# Altium project PCB_Project.PrjPcb
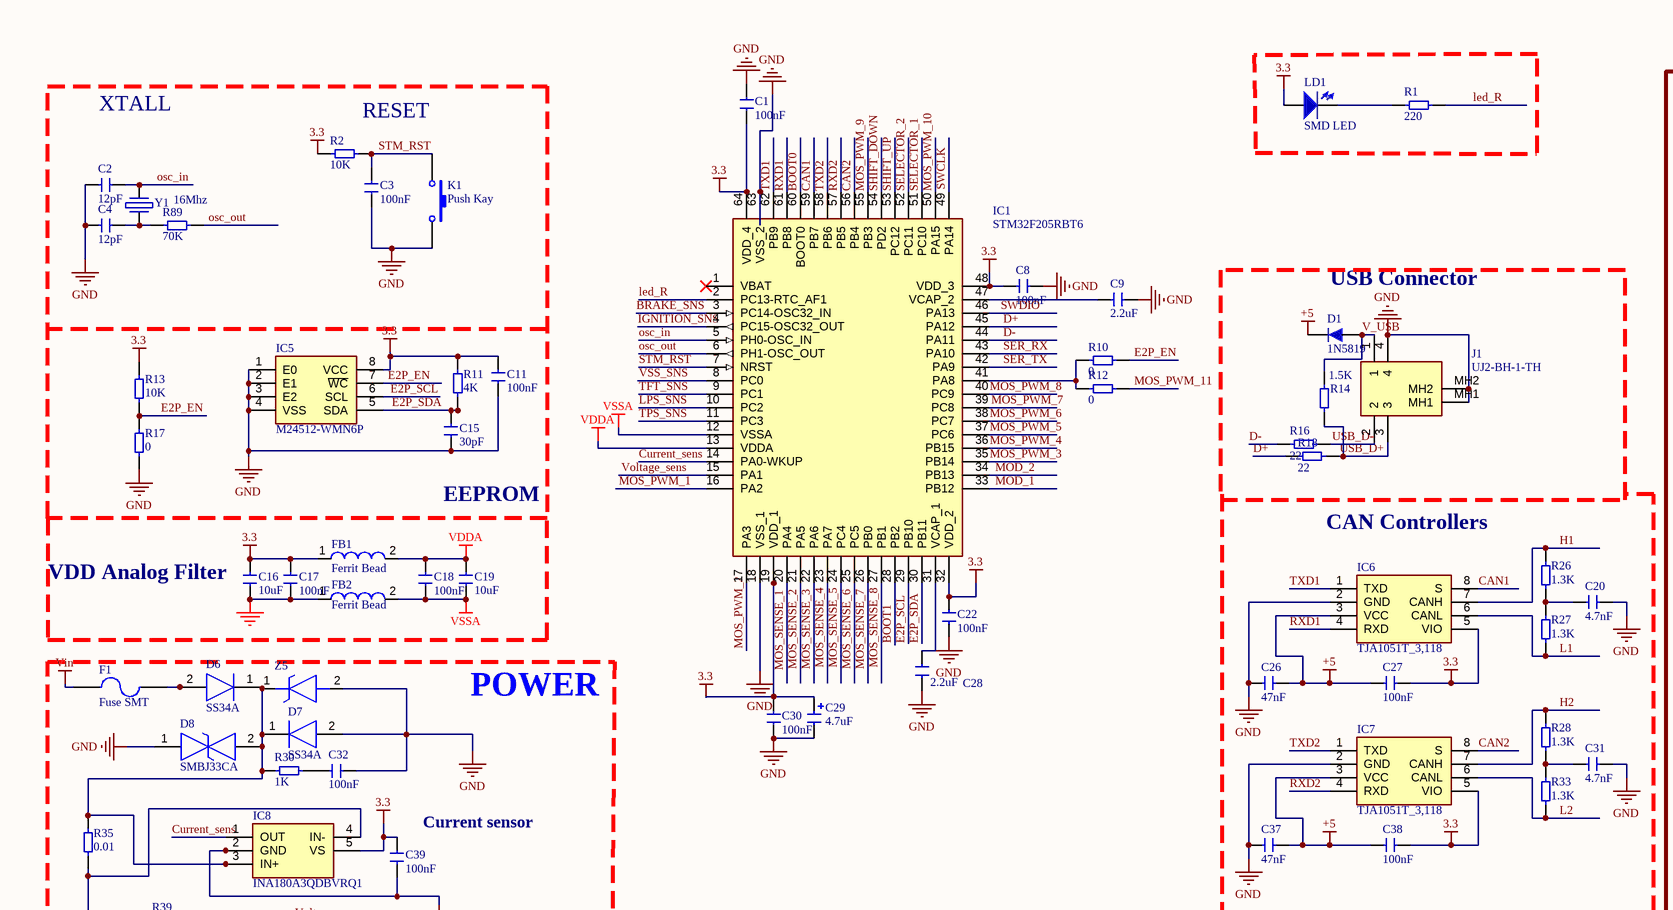
[diagram p0: Sheet_TCU.SchDoc, top left]
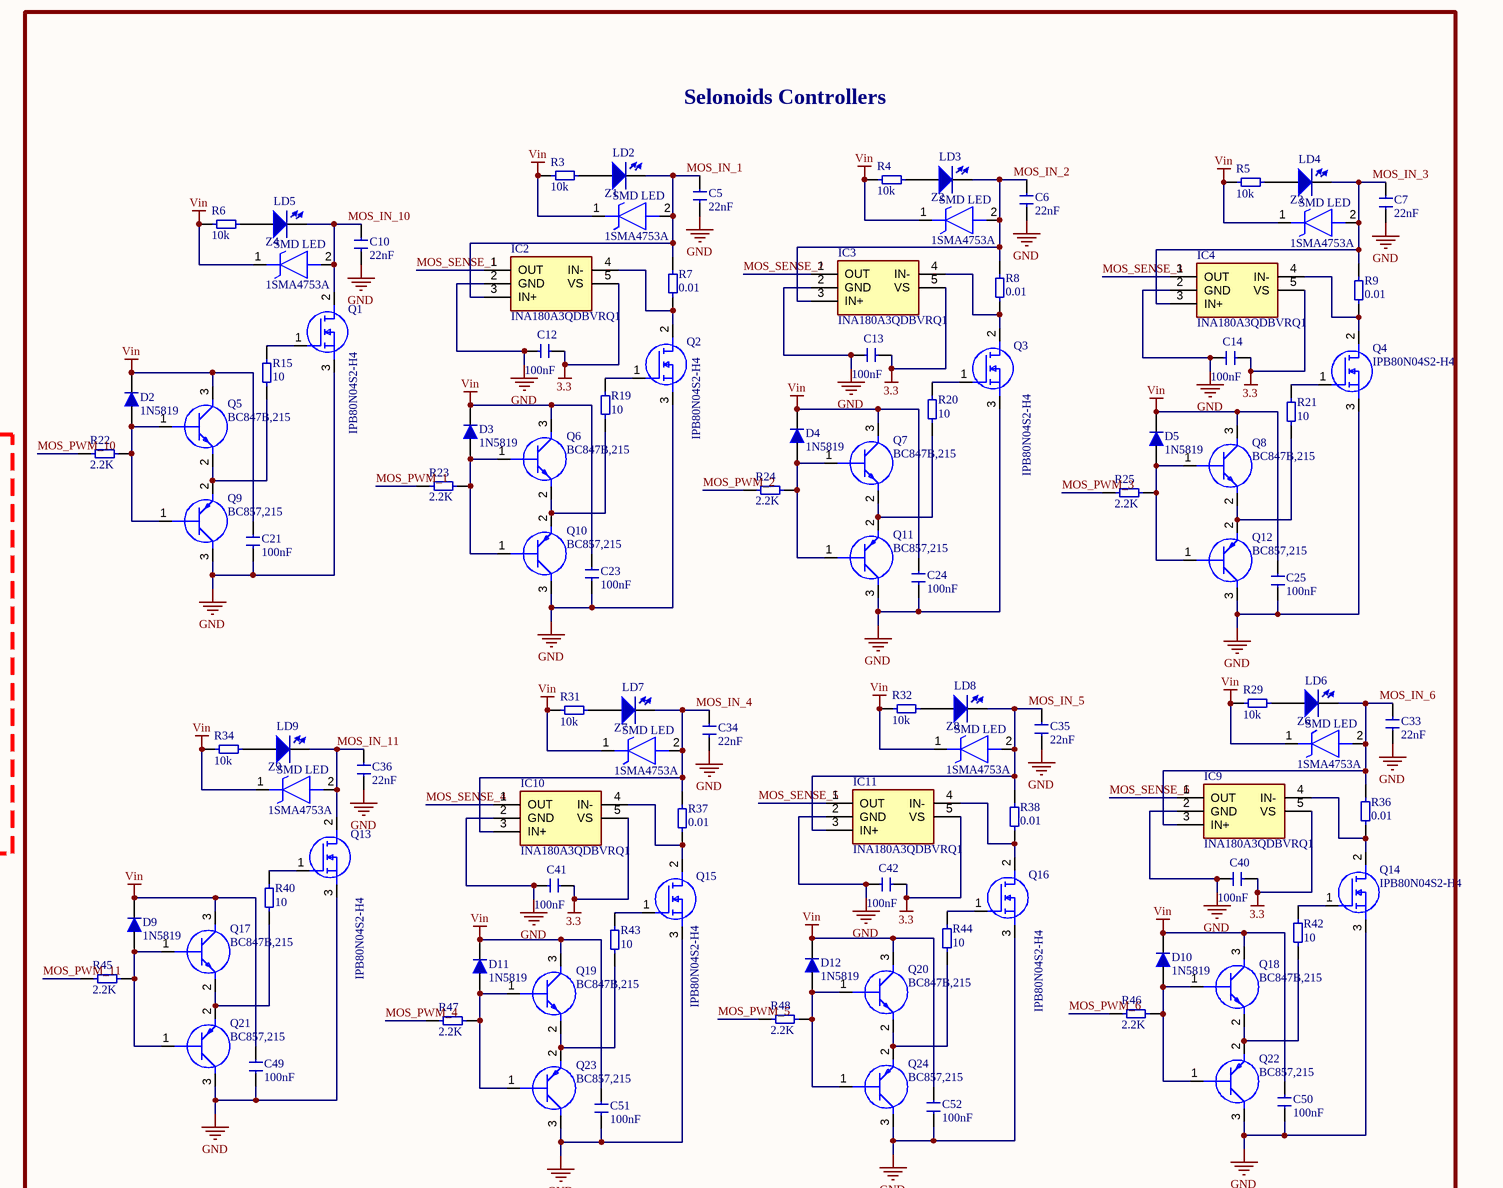
[diagram p1: Sheet_TCU.SchDoc, top right]
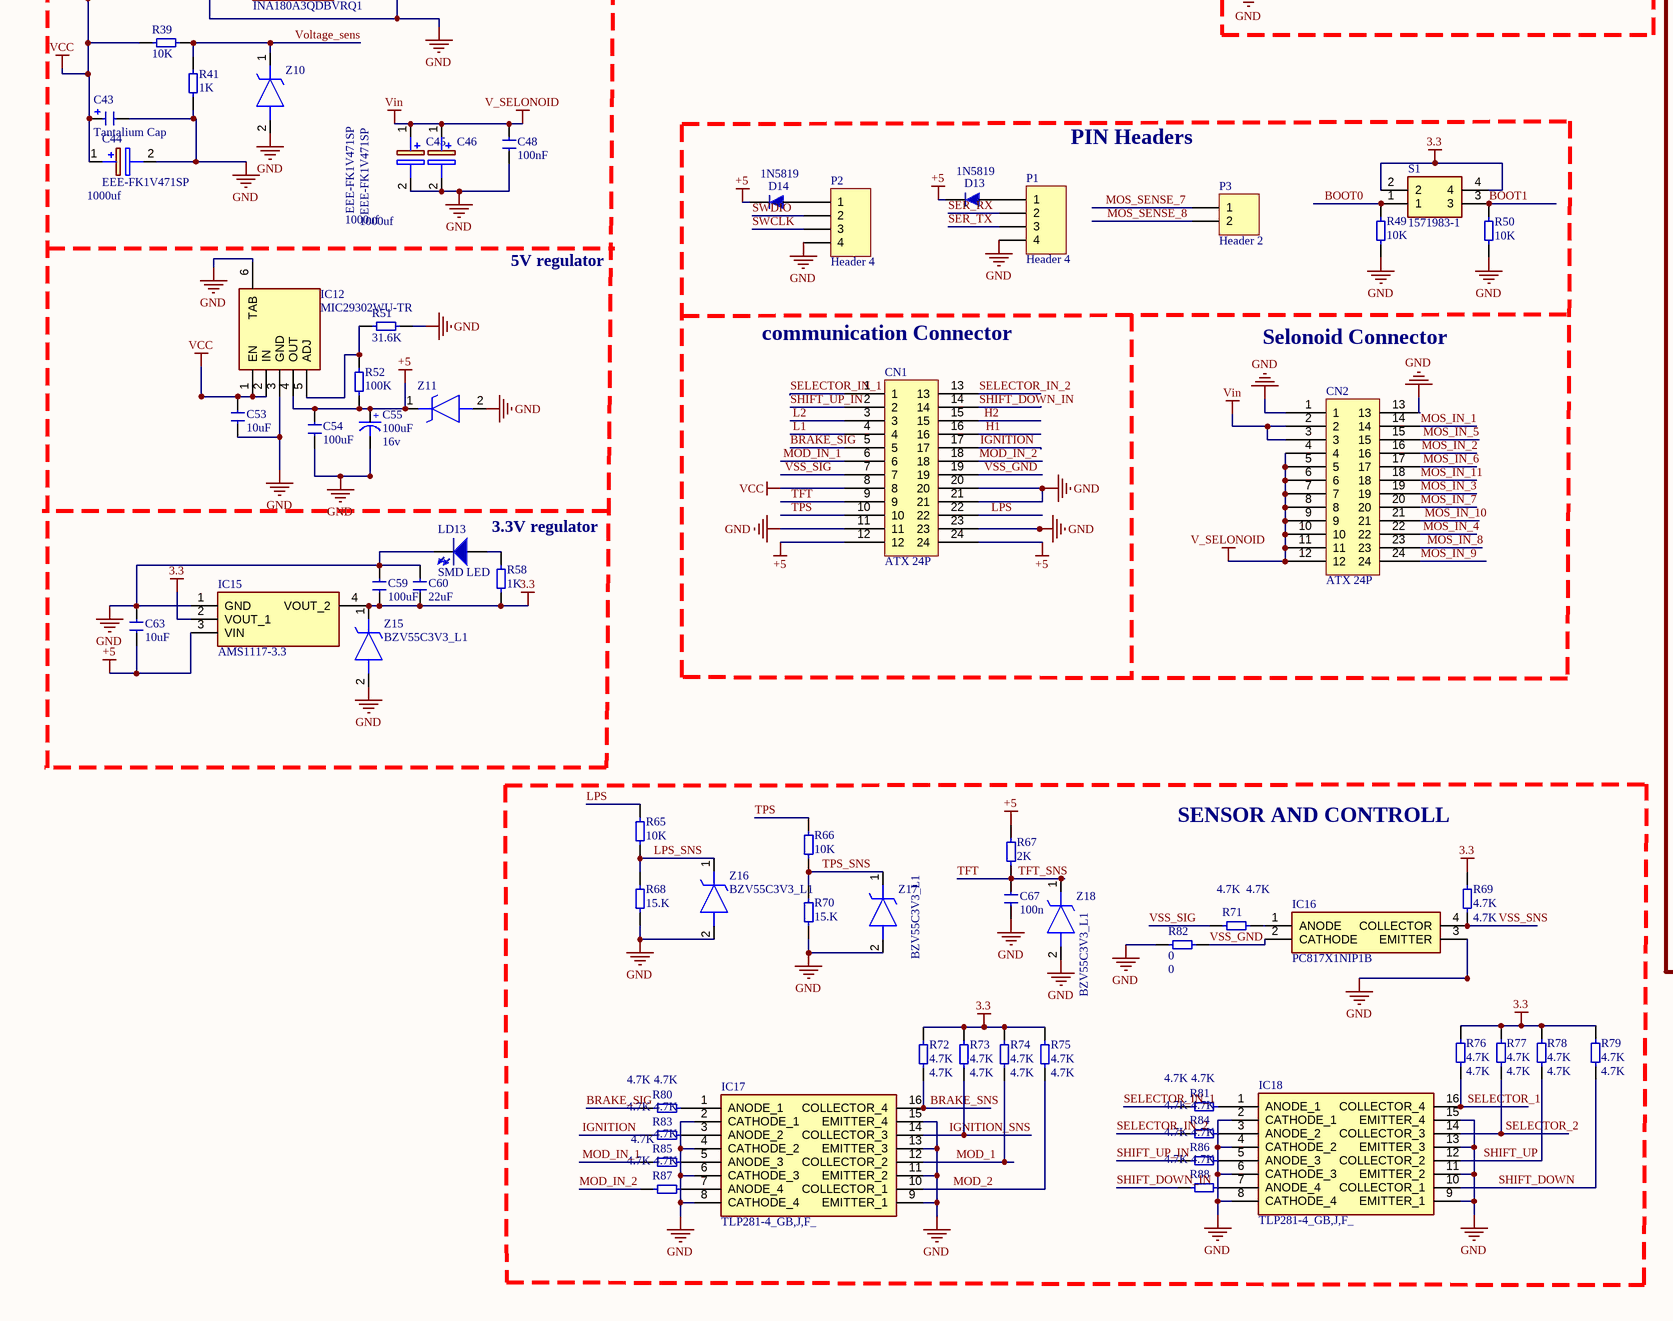
[diagram p2: Sheet_TCU.SchDoc, bottom left]
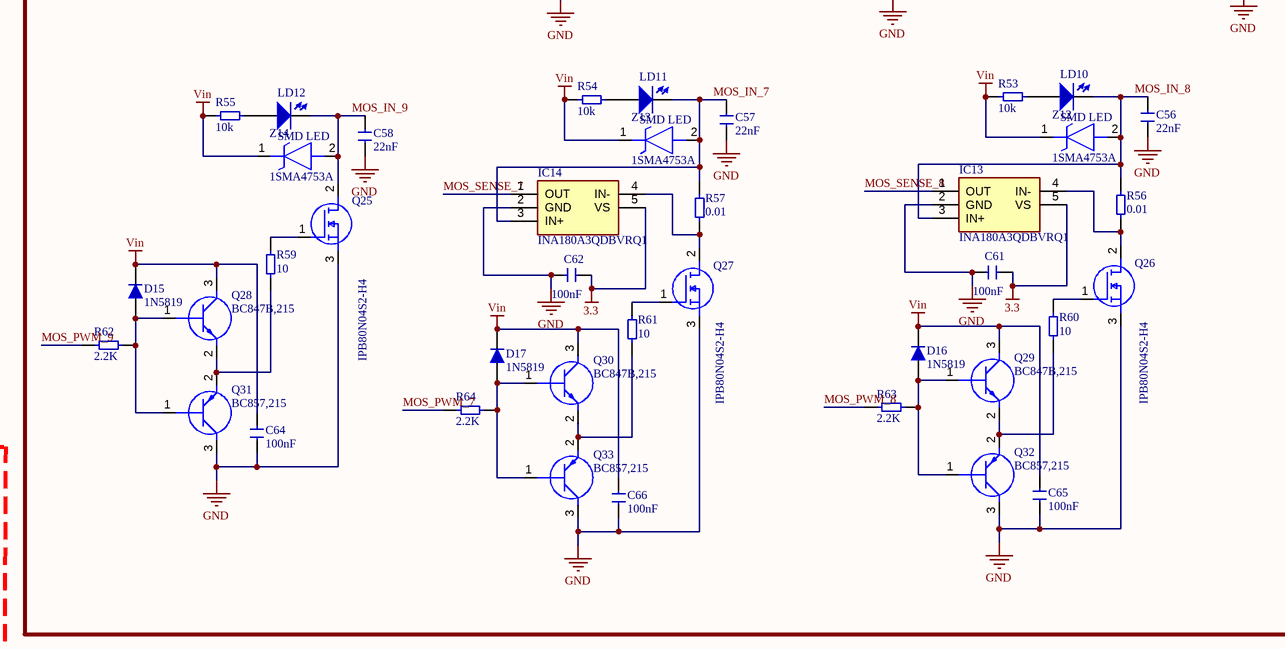
[diagram p3: Sheet_TCU.SchDoc, bottom right]
1 sheet, 266 parts. Net scope: global (net labels, ports and power ports of the same name join across sheets).
Board file: PCB_TCU.PcbDoc

## Sheet Sheet_TCU.SchDoc
size 594 x 420 mm; Organization: Altium Limited; Address1: L3, 12a Rodborough Rd; Address2: Frenchs Forest; Address3: NSW; Address4: Australia 2086

### Parts
C1  value 100nF  [0402 Capacitor]  (hidden comment: Capacitor SMD)
C2  value 12pF  [0402 Capacitor]  (hidden comment: Capacitor SMD)
C3  value 100nF  [0402 Capacitor]  (hidden comment: Capacitor SMD)
C4  value 12pF  [0402 Capacitor]  (hidden comment: Capacitor SMD)
C5  value 22nF  [0402 Capacitor]  (hidden comment: Capacitor SMD)
C6  value 22nF  [0402 Capacitor]  (hidden comment: Capacitor SMD)
C7  value 22nF  [0402 Capacitor]  (hidden comment: Capacitor SMD)
C8  value 100nF  [0402 Capacitor]  (hidden comment: Capacitor SMD)
C9  value 2.2uF  [0402 Capacitor]  (hidden comment: Capacitor SMD)
C10  value 22nF  [0402 Capacitor]  (hidden comment: Capacitor SMD)
C11  value 100nF  [0402 Capacitor]  (hidden comment: Capacitor SMD)
C12  value 100nF  [0402 Capacitor]  (hidden comment: Capacitor SMD)
C13  value 100nF  [0402 Capacitor]  (hidden comment: Capacitor SMD)
C14  value 100nF  [0402 Capacitor]  (hidden comment: Capacitor SMD)
C15  value 30pF  [0402 Capacitor]  (hidden comment: Capacitor SMD)
C16  value 10uF  [0603 Capacitor]  (hidden comment: Capacitor SMD)
C17  value 100nF  [0402 Capacitor]  (hidden comment: Capacitor SMD)
C18  value 100nF  [0402 Capacitor]  (hidden comment: Capacitor SMD)
C19  value 10uF  [0603 Capacitor]  (hidden comment: Capacitor SMD)
C20  value 4.7nF  [0402 Capacitor]  (hidden comment: Capacitor SMD)
C21  value 100nF  [0402 Capacitor]  (hidden comment: Capacitor SMD)
C22  value 100nF  [0402 Capacitor]  (hidden comment: Capacitor SMD)
C23  value 100nF  [0402 Capacitor]  (hidden comment: Capacitor SMD)
C24  value 100nF  [0402 Capacitor]  (hidden comment: Capacitor SMD)
C25  value 100nF  [0402 Capacitor]  (hidden comment: Capacitor SMD)
C26  value 47nF  [0402 Capacitor]  (hidden comment: Capacitor SMD)
C27  value 100nF  [0402 Capacitor]  (hidden comment: Capacitor SMD)
C28  value 2.2uF  [0402 Capacitor]  (hidden comment: Capacitor SMD)
C29  4.7uF  [Tantalium Size A]
C30  value 100nF  [0402 Capacitor]  (hidden comment: Capacitor SMD)
C31  value 4.7nF  [0402 Capacitor]  (hidden comment: Capacitor SMD)
C32  value 100nF  [0805 Capacitor]  (hidden comment: Capacitor SMD)
C33  value 22nF  [0402 Capacitor]  (hidden comment: Capacitor SMD)
C34  value 22nF  [0402 Capacitor]  (hidden comment: Capacitor SMD)
C35  value 22nF  [0402 Capacitor]  (hidden comment: Capacitor SMD)
C36  value 22nF  [0402 Capacitor]  (hidden comment: Capacitor SMD)
C37  value 47nF  [0402 Capacitor]  (hidden comment: Capacitor SMD)
C38  value 100nF  [0402 Capacitor]  (hidden comment: Capacitor SMD)
C39  value 100nF  [0402 Capacitor]  (hidden comment: Capacitor SMD)
C40  value 100nF  [0402 Capacitor]  (hidden comment: Capacitor SMD)
C41  value 100nF  [0402 Capacitor]  (hidden comment: Capacitor SMD)
C42  value 100nF  [0402 Capacitor]  (hidden comment: Capacitor SMD)
C43  Tantalium Cap  [Tantalium Size A]
C44  EEE-FK1V471SP  value 1000uf  [CAPAE1030X1050N]
C45  EEE-FK1V471SP  value 1000uf  [CAPAE1030X1050N]
C46  EEE-FK1V471SP  value 1000uf  [CAPAE1030X1050N]
C48  value 100nF  [0805 Capacitor]  (hidden comment: Capacitor SMD)
C49  value 100nF  [0402 Capacitor]  (hidden comment: Capacitor SMD)
C50  value 100nF  [0402 Capacitor]  (hidden comment: Capacitor SMD)
C51  value 100nF  [0402 Capacitor]  (hidden comment: Capacitor SMD)
C52  value 100nF  [0402 Capacitor]  (hidden comment: Capacitor SMD)
C53  value 10uF  [0603 Capacitor]  (hidden comment: Capacitor SMD)
C54  value 100uF  [0805 Capacitor]  (hidden comment: Capacitor SMD)
C55  Capacitor Aluminum Electrolytic SMD  [Capacitor Aluminum 6.3x7.7]  (value not drawn)
C56  value 22nF  [0402 Capacitor]  (hidden comment: Capacitor SMD)
C57  value 22nF  [0402 Capacitor]  (hidden comment: Capacitor SMD)
C58  value 22nF  [0402 Capacitor]  (hidden comment: Capacitor SMD)
C59  value 100uF  [0805 Capacitor]  (hidden comment: Capacitor SMD)
C60  value 22uF  [0603 Capacitor]  (hidden comment: Capacitor SMD)
C61  value 100nF  [0402 Capacitor]  (hidden comment: Capacitor SMD)
C62  value 100nF  [0402 Capacitor]  (hidden comment: Capacitor SMD)
C63  value 10uF  [0603 Capacitor]  (hidden comment: Capacitor SMD)
C64  value 100nF  [0402 Capacitor]  (hidden comment: Capacitor SMD)
C65  value 100nF  [0402 Capacitor]  (hidden comment: Capacitor SMD)
C66  value 100nF  [0402 Capacitor]  (hidden comment: Capacitor SMD)
C67  value 100n  [0603 Capacitor]  (hidden comment: Capacitor SMD)
CN1  ATX 24P  [ATX 24P]
CN2  ATX 24P  [ATX 24P]
D1  1N5819  [DO-214AC(SMA)]
D2  1N5819  [DO-214AC(SMA)]
D3  1N5819  [DO-214AC(SMA)]
D4  1N5819  [DO-214AC(SMA)]
D5  1N5819  [DO-214AC(SMA)]
D6  SS34A  [DIOM5026X262N]
D7  SS34A  [DIOM5026X262N]
D8  SMBJ33CA  [DIONM5336X265N]
D9  1N5819  [DO-214AC(SMA)]
D10  1N5819  [DO-214AC(SMA)]
D11  1N5819  [DO-214AC(SMA)]
D12  1N5819  [DO-214AC(SMA)]
D13  1N5819  [DO-214AC(SMA)]
D14  1N5819  [DO-214AC(SMA)]
D15  1N5819  [DO-214AC(SMA)]
D16  1N5819  [DO-214AC(SMA)]
D17  1N5819  [DO-214AC(SMA)]
F1  Fuse SMT  [1812 Fuse]
FB1  Ferrit Bead  [0805 Ferrit Bead]
FB2  Ferrit Bead  [0805 Ferrit Bead]
IC1  STM32F205RBT6  [QFP50P1200X1200X160-64N]
IC2  INA180A3QDBVRQ1  [SOT95P280X145-5N]
IC3  INA180A3QDBVRQ1  [SOT95P280X145-5N]
IC4  INA180A3QDBVRQ1  [SOT95P280X145-5N]
IC5  M24512-WMN6P  [SOIC127P600X175-8N]
IC6  TJA1051T_3,118  [SOIC127P600X175-8N]
IC7  TJA1051T_3,118  [SOIC127P600X175-8N]
IC8  INA180A3QDBVRQ1  [SOT95P280X145-5N]
IC9  INA180A3QDBVRQ1  [SOT95P280X145-5N]
IC10  INA180A3QDBVRQ1  [SOT95P280X145-5N]
IC11  INA180A3QDBVRQ1  [SOT95P280X145-5N]
IC12  MIC29302WU-TR  [MIC29302WUTR]
IC13  INA180A3QDBVRQ1  [SOT95P280X145-5N]
IC14  INA180A3QDBVRQ1  [SOT95P280X145-5N]
IC15  AMS1117-3.3  [SOT 223-4]
IC16  PC817X1NIP1B  [SOP254P960X420-4N]
IC17  TLP281-4_GB,J,F_  [SOIC127P700X210-16N]
IC18  TLP281-4_GB,J,F_  [SOIC127P700X210-16N]
J1  UJ2-BH-1-TH  [UJ2BH1TH]
K1  Push Kay  [SW_KFC]
LD1  SMD LED  [LED_0603 R]
LD2  SMD LED  [LED_0603 B]
LD3  SMD LED  [LED_0603 B]
LD4  SMD LED  [LED_0603 B]
LD5  SMD LED  [LED_0603 B]
LD6  SMD LED  [LED_0603 B]
LD7  SMD LED  [LED_0603 B]
LD8  SMD LED  [LED_0603 B]
LD9  SMD LED  [LED_0603 B]
LD10  SMD LED  [LED_0603 B]
LD11  SMD LED  [LED_0603 B]
LD12  SMD LED  [LED_0603 B]
LD13  SMD LED  [LED_0603 R]
P1  Header 4  [HDR1X4]
P2  Header 4  [HDR1X4]
P3  Header 2  [HDR1X2]
Q1  IPB80N04S2-H4  [IRF2804STRLPBF]
Q2  IPB80N04S2-H4  [IRF2804STRLPBF]
Q3  IPB80N04S2-H4  [IRF2804STRLPBF]
Q4  IPB80N04S2-H4  [IRF2804STRLPBF]
Q5  BC847B,215  [BC847B215]
Q6  BC847B,215  [BC847B215]
Q7  BC847B,215  [BC847B215]
Q8  BC847B,215  [BC847B215]
Q9  BC857,215  [BC857215]
Q10  BC857,215  [BC857215]
Q11  BC857,215  [BC857215]
Q12  BC857,215  [BC857215]
Q13  IPB80N04S2-H4  [IRF2804STRLPBF]
Q14  IPB80N04S2-H4  [IRF2804STRLPBF]
Q15  IPB80N04S2-H4  [IRF2804STRLPBF]
Q16  IPB80N04S2-H4  [IRF2804STRLPBF]
Q17  BC847B,215  [BC847B215]
Q18  BC847B,215  [BC847B215]
Q19  BC847B,215  [BC847B215]
Q20  BC847B,215  [BC847B215]
Q21  BC857,215  [BC857215]
Q22  BC857,215  [BC857215]
Q23  BC857,215  [BC857215]
Q24  BC857,215  [BC857215]
Q25  IPB80N04S2-H4  [IRF2804STRLPBF]
Q26  IPB80N04S2-H4  [IRF2804STRLPBF]
Q27  IPB80N04S2-H4  [IRF2804STRLPBF]
Q28  BC847B,215  [BC847B215]
Q29  BC847B,215  [BC847B215]
Q30  BC847B,215  [BC847B215]
Q31  BC857,215  [BC857215]
Q32  BC857,215  [BC857215]
Q33  BC857,215  [BC857215]
R1  value 220  [0402 Resistor]  (hidden comment: Resistor SMD)
R2  value 10K  [0402 Resistor]  (hidden comment: Resistor SMD)
R3  value 10k  [0402 Resistor]  (hidden comment: Resistor SMD)
R4  value 10k  [0402 Resistor]  (hidden comment: Resistor SMD)
R5  value 10k  [0402 Resistor]  (hidden comment: Resistor SMD)
R6  value 10k  [0402 Resistor]  (hidden comment: Resistor SMD)
R7  value 0.01  [2512 Resistor]  (hidden comment: Resistor SMD)
R8  value 0.01  [2512 Resistor]  (hidden comment: Resistor SMD)
R9  value 0.01  [2512 Resistor]  (hidden comment: Resistor SMD)
R10  value 0  [0402 Resistor]  (hidden comment: Resistor SMD)
R11  value 4K  [0402 Resistor]  (hidden comment: Resistor SMD)
R12  value 0  [0402 Resistor]  (hidden comment: Resistor SMD)
R13  value 10K  [0402 Resistor]  (hidden comment: Resistor SMD)
R14  value 1.5K  [0402 Resistor]  (hidden comment: Resistor SMD)
R15  value 10  [0402 Resistor]  (hidden comment: Resistor SMD)
R16  value 22  [0402 Resistor]  (hidden comment: Resistor SMD)
R17  value 0  [0402 Resistor]  (hidden comment: Resistor SMD)
R18  value 22  [0402 Resistor]  (hidden comment: Resistor SMD)
R19  value 10  [0402 Resistor]  (hidden comment: Resistor SMD)
R20  value 10  [0402 Resistor]  (hidden comment: Resistor SMD)
R21  value 10  [0402 Resistor]  (hidden comment: Resistor SMD)
R22  value 2.2K  [0402 Resistor]  (hidden comment: Resistor SMD)
R23  value 2.2K  [0402 Resistor]  (hidden comment: Resistor SMD)
R24  value 2.2K  [0402 Resistor]  (hidden comment: Resistor SMD)
R25  value 2.2K  [0402 Resistor]  (hidden comment: Resistor SMD)
R26  value 1.3K  [0402 Resistor]  (hidden comment: Resistor SMD)
R27  value 1.3K  [0402 Resistor]  (hidden comment: Resistor SMD)
R28  value 1.3K  [0402 Resistor]  (hidden comment: Resistor SMD)
R29  value 10k  [0402 Resistor]  (hidden comment: Resistor SMD)
R30  value 1K  [0805 Resistor]  (hidden comment: Resistor SMD)
R31  value 10k  [0402 Resistor]  (hidden comment: Resistor SMD)
R32  value 10k  [0402 Resistor]  (hidden comment: Resistor SMD)
R33  value 1.3K  [0402 Resistor]  (hidden comment: Resistor SMD)
R34  value 10k  [0402 Resistor]  (hidden comment: Resistor SMD)
R35  value 0.01  [0805 Resistor]  (hidden comment: Resistor SMD)
R36  value 0.01  [2512 Resistor]  (hidden comment: Resistor SMD)
R37  value 0.01  [2512 Resistor]  (hidden comment: Resistor SMD)
R38  value 0.01  [2512 Resistor]  (hidden comment: Resistor SMD)
R39  value 10K  [0402 Resistor]  (hidden comment: Resistor SMD)
R40  value 10  [0402 Resistor]  (hidden comment: Resistor SMD)
R41  value 1K  [0402 Resistor]  (hidden comment: Resistor SMD)
R42  value 10  [0402 Resistor]  (hidden comment: Resistor SMD)
R43  value 10  [0402 Resistor]  (hidden comment: Resistor SMD)
R44  value 10  [0402 Resistor]  (hidden comment: Resistor SMD)
R45  value 2.2K  [0402 Resistor]  (hidden comment: Resistor SMD)
R46  value 2.2K  [0402 Resistor]  (hidden comment: Resistor SMD)
R47  value 2.2K  [0402 Resistor]  (hidden comment: Resistor SMD)
R48  value 2.2K  [0402 Resistor]  (hidden comment: Resistor SMD)
R49  value 10K  [0402 Resistor]  (hidden comment: Resistor SMD)
R50  value 10K  [0402 Resistor]  (hidden comment: Resistor SMD)
R51  value 31.6K  [0603 Resistor]  (hidden comment: Resistor SMD)
R52  value 100K  [0603 Resistor]  (hidden comment: Resistor SMD)
R53  value 10k  [0402 Resistor]  (hidden comment: Resistor SMD)
R54  value 10k  [0402 Resistor]  (hidden comment: Resistor SMD)
R55  value 10k  [0402 Resistor]  (hidden comment: Resistor SMD)
R56  value 0.01  [2512 Resistor]  (hidden comment: Resistor SMD)
R57  value 0.01  [2512 Resistor]  (hidden comment: Resistor SMD)
R58  value 1K  [0402 Resistor]  (hidden comment: Resistor SMD)
R59  value 10  [0402 Resistor]  (hidden comment: Resistor SMD)
R60  value 10  [0402 Resistor]  (hidden comment: Resistor SMD)
R61  value 10  [0402 Resistor]  (hidden comment: Resistor SMD)
R62  value 2.2K  [0402 Resistor]  (hidden comment: Resistor SMD)
R63  value 2.2K  [0402 Resistor]  (hidden comment: Resistor SMD)
R64  value 2.2K  [0402 Resistor]  (hidden comment: Resistor SMD)
R65  value 10K  [0402 Resistor]  (hidden comment: Resistor SMD)
R66  value 10K  [0402 Resistor]  (hidden comment: Resistor SMD)
R67  value 2K  [0402 Resistor]  (hidden comment: Resistor SMD)
R68  value 15.K  [0402 Resistor]  (hidden comment: Resistor SMD)
R69  4.7K  [0402 Resistor]
R70  value 15.K  [0402 Resistor]  (hidden comment: Resistor SMD)
R71  4.7K  [0402 Resistor]
R72  4.7K  [0402 Resistor]
R73  4.7K  [0402 Resistor]
R74  4.7K  [0402 Resistor]
R75  4.7K  [0402 Resistor]
R76  4.7K  [0402 Resistor]
R77  4.7K  [0402 Resistor]
R78  4.7K  [0402 Resistor]
R79  4.7K  [0402 Resistor]
R80  4.7K  [0402 Resistor]
R81  4.7K  [0402 Resistor]
R82  0  [0603 Resistor]
R83  4.7K  [0402 Resistor]
R84  4.7K  [0402 Resistor]
R85  4.7K  [0402 Resistor]
R86  4.7K  [0402 Resistor]
R87  4.7K  [0402 Resistor]
R88  4.7K  [0402 Resistor]
R89  value 70K  [0402 Resistor]  (hidden comment: Resistor SMD)
S1  1571983-1  [15719831]
Y1  16Mhz  [Xtal 2p SMD]
Z1  1SMA4753A  [DIOM5527X250N]
Z2  1SMA4753A  [DIOM5527X250N]
Z3  1SMA4753A  [DIOM5527X250N]
Z4  1SMA4753A  [DIOM5527X250N]
Z5  (no value)  [BZV55C3V3L1]
Z6  1SMA4753A  [DIOM5527X250N]
Z7  1SMA4753A  [DIOM5527X250N]
Z8  1SMA4753A  [DIOM5527X250N]
Z9  1SMA4753A  [DIOM5527X250N]
Z10  (no value)  [BZV55C3V3L1]
Z11  (no value)  [BZV55C3V3L1]
Z12  1SMA4753A  [DIOM5527X250N]
Z13  1SMA4753A  [DIOM5527X250N]
Z14  1SMA4753A  [DIOM5527X250N]
Z15  BZV55C3V3_L1  [BZV55C3V3L1]
Z16  BZV55C3V3_L1  [BZV55C3V3L1]
Z17  BZV55C3V3_L1  [BZV55C3V3L1]
Z18  BZV55C3V3_L1  [BZV55C3V3L1]

### Blocks framed on the sheet
Selonoids Controllers: C5-C7 C10 C12-C14 C21 C23-C25 C33-C36 C40-C42 C49-C52 C56-C58 C61 C62 C64-C66 D2-D5 D9-D12 D15-D17 IC2-IC4 IC9-IC11 IC13 IC14 LD2-LD12 Q1-Q33 R3-R9 R15 R19-R25 R29 R31 R32 R34 R36-R38 R40 R42-R48 R53-R57 R59-R64 Z1-Z4 Z6-Z9 Z12-Z14
USB Connector: D1 J1 R14 R16 R18
POWER: C32 C39 C43-C46 C48 C53-C55 C59 C60 C63 D6-D8 F1 IC8 IC12 IC15 LD13 R30 R35 R39 R41 R51 R52 R58 Z5 Z10 Z11 Z15
SENSOR AND CONTROLL: C67 IC16-IC18 R65-R88 Z16-Z18

### Nets
3.3: C1.1 C8.1 C11.1 C12.2 C13.2 C14.2 C16.2 C17.1 C22.1 C27.1 C29.1 C30.1 C38.1 C39.1 C40.2 C41.2 C42.2 C59.1 C60.1 C61.2 C62.2 FB1.1 IC1.19(VDD_1) IC1.32(VDD_2) IC1.48(VDD_3) IC1.64(VDD_4) IC2.5(VS) IC3.5(VS) IC4.5(VS) IC5.8(VCC) IC6.5(VIO) IC7.5(VIO) IC8.5(VS) IC9.5(VS) IC10.5(VS) IC11.5(VS) IC13.5(VS) IC14.5(VS) IC15.2(VOUT_1) IC15.4(VOUT_2) LD1.1(A) R2.2 R11.1 R13.1 R58.2 R69.1 R72.1 R73.1 R74.1 R75.1 R76.1 R77.1 R78.1 R79.1 S1.2 S1.4 Z15.1(K)
+5: C26.1 C27.2 C37.1 C38.2 C54.2 C55.1(+) C63.1 CN1.12 CN1.24 D1.2 D13.2 D14.2 IC6.3(VCC) IC7.3(VCC) IC12.4(OUT) IC15.3(VIN) R52.2 R67.1 Z11.1(K)
GND: C1.2 C2.1 C3.2 C4.1 C5.1 C6.1 C7.1 C8.2 C9.2 C10.1 C11.2 C12.1 C13.1 C14.1 C15.2 C16.1 C17.2 C20.1 C21.1 C22.2 C23.1 C24.1 C25.1 C26.2 C28.2 C29.2 C30.2 C31.1 C32.2 C33.1 C34.1 C35.1 C36.1 C37.2 C39.2 C40.1 C41.1 C42.1 C43.2 C44.2(-) C45.2(-) C46.2(-) C48.2 C49.1 C50.1 C51.1 C52.1 C53.1 C54.1 C55.2(-) C56.1 C57.1 C58.1 C59.2 C60.2 C61.1 C62.1 C63.2 C64.1 C65.1 C66.1 C67.1 CN1.11 CN1.20 CN1.21 CN1.23 CN2.1 CN2.13 D7.2(A) D8.1 FB2.1 IC1.18(VSS_1) IC1.63(VSS_2) IC2.2(GND) IC3.2(GND) IC4.2(GND) IC5.1(E0) IC5.2(E1) IC5.3(E2) IC5.4(VSS) IC6.2(GND) IC7.2(GND) IC8.2(GND) IC9.2(GND) IC10.2(GND) IC11.2(GND) IC12.3(GND) IC12.6(TAB) IC13.2(GND) IC14.2(GND) IC15.1(GND) IC16.3(EMITTER) IC17.2(CATHODE_1) IC17.4(CATHODE_2) IC17.6(CATHODE_3) IC17.8(CATHODE_4) IC17.9(EMITTER_1) IC17.11(EMITTER_2) IC17.13(EMITTER_3) IC17.15(EMITTER_4) IC18.2(CATHODE_1) IC18.4(CATHODE_2) IC18.6(CATHODE_3) IC18.8(CATHODE_4) IC18.9(EMITTER_1) IC18.11(EMITTER_2) IC18.13(EMITTER_3) IC18.15(EMITTER_4) J1.4 J1.MH1 J1.MH2 K1.2 LD13.2(K) P1.4 P2.4 Q1.3(S) Q2.3(S) Q3.3(S) Q4.3(S) Q9.3(C) Q10.3(C) Q11.3(C) Q12.3(C) Q13.3(S) Q14.3(S) Q15.3(S) Q16.3(S) Q21.3(C) Q22.3(C) Q23.3(C) Q24.3(C) Q25.3(S) Q26.3(S) Q27.3(S) Q31.3(C) Q32.3(C) Q33.3(C) R17.2 R41.2 R49.2 R50.1 R51.1 R68.2 R70.2 R82.1 Z5.2(A) Z10.2(A) Z11.2(A) Z15.2(A) Z16.2(A) Z17.2(A) Z18.2(A)
V_SELONOID: C21.2 C23.2 C24.2 C25.2 C45.1(+) C46.1(+) C48.1 C49.2 C50.2 C51.2 C52.2 C64.2 C65.2 C66.2 CN2.2 CN2.3 CN2.4 CN2.5 CN2.6 CN2.7 CN2.8 CN2.9 CN2.10 CN2.11 CN2.12 D2.2 D3.2 D4.2 D5.2 D9.2 D10.2 D11.2 D12.2 D15.2 D16.2 D17.2 F1.1 Q5.3(C) Q6.3(C) Q7.3(C) Q8.3(C) Q17.3(C) Q18.3(C) Q19.3(C) Q20.3(C) Q28.3(C) Q29.3(C) Q30.3(C) R3.2 R4.2 R5.2 R6.2 R29.2 R31.2 R32.2 R34.2 R53.2 R54.2 R55.2 Z1.1(K) Z2.1(K) Z3.1(K) Z4.1(K) Z6.1(K) Z7.1(K) Z8.1(K) Z9.1(K) Z12.1(K) Z13.1(K) Z14.1(K)  [also labelled Vin]
VCC: C43.1 C44.1(+) C53.2 CN1.8 IC8.4(IN-) IC12.1(EN) IC12.2(IN) R35.1 R39.1
VDDA: C18.1 C19.2 FB1.2 IC1.13(VDDA)
VSSA: C18.2 C19.1 FB2.2 IC1.12(VSSA)
BOOT0: IC1.60(BOOT0) R49.1 S1.1
BOOT1: IC1.28(PB2) R50.2 S1.3
BRAKE_SIG: CN1.5 R80.1
BRAKE_SNS: IC1.3(PC14-OSC32_IN) IC17.16(COLLECTOR_4) R72.2
CAN1: IC1.59(PB7) IC6.8(S)
CAN2: IC1.56(PB4) IC7.8(S)
Current_sens: IC1.14(PA0-WKUP) IC8.1(OUT)
D+: IC1.45(PA12) R18.1
D-: IC1.44(PA11) R16.1
E2P_EN: IC5.7(~{WC}) R10.2 R13.2 R17.1
E2P_SCL: IC1.29(PB10) IC5.6(SCL)
E2P_SDA: C15.1 IC1.30(PB11) IC5.5(SDA) R11.2
H1: CN1.16 IC6.7(CANH) R26.2
H2: CN1.15 IC7.7(CANH) R28.2
IGNITION: CN1.17 R83.1
IGNITION_SNS: IC1.4(PC15-OSC32_OUT) IC17.14(COLLECTOR_3) R73.2
L1: CN1.4 IC6.6(CANL) R27.1
L2: CN1.3 IC7.6(CANL) R33.1
led_R: IC1.2(PC13-RTC_AF1) R1.1
LPS: CN1.22 R65.1
LPS_SNS: IC1.10(PC2) R65.2 R68.1 Z16.1(K)
MOD_1: IC1.33(PB12) IC17.12(COLLECTOR_2) R74.2
MOD_2: IC1.34(PB13) IC17.10(COLLECTOR_1) R75.2
MOD_IN_1: CN1.6 R85.1
MOD_IN_2: CN1.18 R87.1
MOS_IN_1: C5.2 CN2.14 IC2.3(IN+) LD2.2(K) R7.2 Z1.2(A)
MOS_IN_2: C6.2 CN2.16 IC3.3(IN+) LD3.2(K) R8.2 Z2.2(A)
MOS_IN_3: C7.2 CN2.19 IC4.3(IN+) LD4.2(K) R9.2 Z3.2(A)
MOS_IN_4: C34.2 CN2.22 IC10.3(IN+) LD7.2(K) R37.2 Z7.2(A)
MOS_IN_5: C35.2 CN2.15 IC11.3(IN+) LD8.2(K) R38.2 Z8.2(A)
MOS_IN_6: C33.2 CN2.17 IC9.3(IN+) LD6.2(K) R36.2 Z6.2(A)
MOS_IN_7: C57.2 CN2.20 IC14.3(IN+) LD11.2(K) R57.2 Z13.2(A)
MOS_IN_8: C56.2 CN2.23 IC13.3(IN+) LD10.2(K) R56.2 Z12.2(A)
MOS_IN_9: C58.2 CN2.24 LD12.2(K) Q25.2(D) Z14.2(A)
MOS_IN_10: C10.2 CN2.21 LD5.2(K) Q1.2(D) Z4.2(A)
MOS_IN_11: C36.2 CN2.18 LD9.2(K) Q13.2(D) Z9.2(A)
MOS_PWM_1: IC1.16(PA2) R23.2
MOS_PWM_2: IC1.17(PA3) R24.2
MOS_PWM_3: IC1.35(PB14) R25.2
MOS_PWM_4: IC1.36(PB15) R47.2
MOS_PWM_5: IC1.37(PC6) R48.2
MOS_PWM_6: IC1.38(PC7) R46.2
MOS_PWM_7: IC1.39(PC8) R64.2
MOS_PWM_8: IC1.40(PC9) R63.2
MOS_PWM_9: IC1.55(PB3) R62.2
MOS_PWM_10: IC1.50(PA15) R22.2
MOS_PWM_11: R12.1 R45.2
MOS_SENSE_1: IC1.20(PA4) IC2.1(OUT)
MOS_SENSE_2: IC1.21(PA5) IC3.1(OUT)
MOS_SENSE_3: IC1.22(PA6) IC4.1(OUT)
MOS_SENSE_4: IC1.23(PA7) IC10.1(OUT)
MOS_SENSE_5: IC1.24(PC4) IC11.1(OUT)
MOS_SENSE_6: IC1.25(PC5) IC9.1(OUT)
MOS_SENSE_7: IC1.26(PB0) IC14.1(OUT) P3.1
MOS_SENSE_8: IC1.27(PB1) IC13.1(OUT) P3.2
osc_in: C2.2 IC1.5(PH0-OSC_IN) Y1.2
osc_out: IC1.6(PH1-OSC_OUT) R89.1
RXD1: IC1.61(PB8) IC6.4(RXD)
RXD2: IC1.57(PB5) IC7.4(RXD)
SELECTOR_1: IC1.51(PC10) IC18.16(COLLECTOR_4) R76.2
SELECTOR_2: IC1.52(PC11) IC18.14(COLLECTOR_3) R77.2
SELECTOR_IN_1: CN1.1 R81.1
SELECTOR_IN_2: CN1.13 R84.1
SER_RX: IC1.43(PA10) P1.2
SER_TX: IC1.42(PA9) P1.3
SHIFT_DOWN: IC1.54(PD2) IC18.10(COLLECTOR_1) R79.2
SHIFT_DOWN_IN: CN1.14 R88.1
SHIFT_UP: IC1.53(PC12) IC18.12(COLLECTOR_2) R78.2
SHIFT_UP_IN: CN1.2 R86.1
STM_RST: C3.1 IC1.7(NRST) K1.1 R2.1
SWCLK: IC1.49(PA14) P2.3
SWDIO: IC1.46(PA13) P2.2
TFT: C67.2 CN1.9 IC1.9(PC1) R67.2 Z18.1(K)  [also labelled TFT_SNS]
TPS: CN1.10 R66.1
TPS_SNS: IC1.11(PC3) R66.2 R70.1 Z17.1(K)
TXD1: IC1.62(PB9) IC6.1(TXD)
TXD2: IC1.58(PB6) IC7.1(TXD)
USB_D+: J1.3 R14.1 R18.2
USB_D-: J1.2 R16.2
V_USB: D1.1 J1.1 R14.2
Voltage_sens: IC1.15(PA1) R39.2 R41.1 Z10.1(K)
VSS_GND: CN1.19 IC16.2(CATHODE) R82.2
VSS_SIG: CN1.7 R71.1
VSS_SNS: IC1.8(PC0) IC16.4(COLLECTOR) R69.2
NetC4_2: C4.2 R89.2 Y1.1
NetC9_1: C9.1 IC1.47(VCAP_2)
NetC20_2: C20.2 R26.1 R27.2
NetC28_1: C28.1 IC1.31(VCAP_1)
NetC31_2: C31.2 R28.1 R33.2
NetC32_1: C32.1 R30.2
NetD2_1: D2.1 Q5.1(B) Q9.1(B) R22.1
NetD3_1: D3.1 Q6.1(B) Q10.1(B) R23.1
NetD4_1: D4.1 Q7.1(B) Q11.1(B) R24.1
NetD5_1: D5.1 Q8.1(B) Q12.1(B) R25.1
NetD6_1: D6.1(K) D7.1(K) D8.2 IC8.3(IN+) R30.1 R35.2 Z5.1(K)
NetD6_2: D6.2(A) F1.2
NetD9_1: D9.1 Q17.1(B) Q21.1(B) R45.1
NetD10_1: D10.1 Q18.1(B) Q22.1(B) R46.1
NetD11_1: D11.1 Q19.1(B) Q23.1(B) R47.1
NetD12_1: D12.1 Q20.1(B) Q24.1(B) R48.1
NetD13_1: D13.1 P1.1
NetD14_1: D14.1 P2.1
NetD15_1: D15.1 Q28.1(B) Q31.1(B) R62.1
NetD16_1: D16.1 Q29.1(B) Q32.1(B) R63.1
NetD17_1: D17.1 Q30.1(B) Q33.1(B) R64.1
NetIC1_41: IC1.41(PA8) R10.1 R12.2
NetIC2_4: IC2.4(IN-) Q2.2(D) R7.1
NetIC3_4: IC3.4(IN-) Q3.2(D) R8.1
NetIC4_4: IC4.4(IN-) Q4.2(D) R9.1
NetIC9_4: IC9.4(IN-) Q14.2(D) R36.1
NetIC10_4: IC10.4(IN-) Q15.2(D) R37.1
NetIC11_4: IC11.4(IN-) Q16.2(D) R38.1
NetIC12_5: IC12.5(ADJ) R51.2 R52.1
NetIC13_4: IC13.4(IN-) Q26.2(D) R56.1
NetIC14_4: IC14.4(IN-) Q27.2(D) R57.1
NetIC16_1: IC16.1(ANODE) R71.2
NetIC17_1: IC17.1(ANODE_1) R80.2
NetIC17_3: IC17.3(ANODE_2) R83.2
NetIC17_5: IC17.5(ANODE_3) R85.2
NetIC17_7: IC17.7(ANODE_4) R87.2
NetIC18_1: IC18.1(ANODE_1) R81.2
NetIC18_3: IC18.3(ANODE_2) R84.2
NetIC18_5: IC18.5(ANODE_3) R86.2
NetIC18_7: IC18.7(ANODE_4) R88.2
NetLD1_2: LD1.2(K) R1.2
NetLD2_1: LD2.1(A) R3.1
NetLD3_1: LD3.1(A) R4.1
NetLD4_1: LD4.1(A) R5.1
NetLD5_1: LD5.1(A) R6.1
NetLD6_1: LD6.1(A) R29.1
NetLD7_1: LD7.1(A) R31.1
NetLD8_1: LD8.1(A) R32.1
NetLD9_1: LD9.1(A) R34.1
NetLD10_1: LD10.1(A) R53.1
NetLD11_1: LD11.1(A) R54.1
NetLD12_1: LD12.1(A) R55.1
NetLD13_1: LD13.1(A) R58.1
NetQ1_1: Q1.1(G) R15.2
NetQ2_1: Q2.1(G) R19.2
NetQ3_1: Q3.1(G) R20.2
NetQ4_1: Q4.1(G) R21.2
NetQ5_2: Q5.2(E) Q9.2(E) R15.1
NetQ6_2: Q6.2(E) Q10.2(E) R19.1
NetQ7_2: Q7.2(E) Q11.2(E) R20.1
NetQ8_2: Q8.2(E) Q12.2(E) R21.1
NetQ13_1: Q13.1(G) R40.2
NetQ14_1: Q14.1(G) R42.2
NetQ15_1: Q15.1(G) R43.2
NetQ16_1: Q16.1(G) R44.2
NetQ17_2: Q17.2(E) Q21.2(E) R40.1
NetQ18_2: Q18.2(E) Q22.2(E) R42.1
NetQ19_2: Q19.2(E) Q23.2(E) R43.1
NetQ20_2: Q20.2(E) Q24.2(E) R44.1
NetQ25_1: Q25.1(G) R59.2
NetQ26_1: Q26.1(G) R60.2
NetQ27_1: Q27.1(G) R61.2
NetQ28_2: Q28.2(E) Q31.2(E) R59.1
NetQ29_2: Q29.2(E) Q32.2(E) R60.1
NetQ30_2: Q30.2(E) Q33.2(E) R61.1

Not connected (* = marked no-connect by the designer): IC1 1(VBAT)*

### Notes on the sheet
- XTALL
- (near R2) RESET
- EEPROM
- CAN Controllers
- (near C16) VDD Analog Filter
- (near C39) Current sensor
- PIN Headers
- 5V regulator
- (near CN1) communication Connector
- Selonoid Connector
- 3.3V regulator
- DWG NO:
- REV:
- THIS DOCUMENT AND THE DATA DISCLOSED HEREIN OR
- HEREWITH IS THE PROPERTY OF ALTIUM LIMITED AND MAY
- BE FREELY DISTRIBUTED IN WHOLE. NO RIGHTS ARE
- RESERVED OR EXPRESS OR IMPLIED WARANTEE GIVEN.
- REVISION
- DESCRIPTION
- DATE
- APPROVED
- ENG:
- APPROVALS
- PROJECT
- DSN:
- CHK:
- REFERENCE DOCUMENTS
- PROJECT REVISION:
- TITLE
- DOCUMENT REVISION:
- DESIGN ITEM:
- BOM:
- FAB DWG:
- PCB DWG:
- ASSY DWG:
- SCALE:
- A2
- SIZE
- CAGE CODE
- FILE NAME
- DWG NO.
- SHEET
- OF
- REV
- (in symbol Capacitor Aluminum Electrolytic SMD) 100uF; 16v

### Library data of the parts
C29 = Capacitor Tantalium
C43 = Capacitor Tantalium: 100nF
C44-C46 = EEE-FK1V471SP: Capacitor Polarised; Manufacturer_Name: Panasonic; Datasheet Link: https://industrial.panasonic.com/cdbs/www-data/pdf/RDE0000/ABA0000C1251.pdf; Height: 10.5mm; Manufacturer_Part_Number: EEE-FK1V471SP; Mouser Part Number: 667-EEE-FK1V471SP; Mouser Price/Stock: https://www.mouser.co.uk/ProductDetail/Panasonic/EEE-FK1V471SP?qs=zOMD8z%2Fhl68xqw9uR0oqiw%3D%3D; Arrow Part Number: EEE-FK1V471SP; Arrow Price/Stock: https://www.arrow.com/en/products/eee-fk1v471sp/panasonic
D1-D5 D9-D17 = 1N5819(SS14)
D6 D7 = SS34A: Diode; Manufacturer_Name: HY Electronic Corp; Datasheet Link: http://docs-emea.rs-online.com/webdocs/14bb/0900766b814bbf89.pdf; Height: 2.62mm; Manufacturer_Part_Number: SS34A
D8 = SMBJ33CA: TVS Diode (Bi-directional); Manufacturer_Name: Taiwan Semiconductor; Datasheet Link: https://datasheet.datasheetarchive.com/originals/distributors/Datasheets_SAMA/e97e318f9f7ff3af29a1fb11dd25909f.pdf; Height: 2.65mm; Manufacturer_Part_Number: SMBJ33CA; Mouser Part Number: 821-SMBJ33CA; Mouser Price/Stock: https://www.mouser.co.uk/ProductDetail/Taiwan-Semiconductor/SMBJ33CA?qs=tHU%2FlV7kTyTRzpQL1k66fQ%3D%3D; Arrow Part Number: SMBJ33CA; Arrow Price/Stock: https://www.arrow.com/en/products/smbj33ca/taiwan-semiconductor?region=nac
IC1 = STM32F205RBT6: Integrated Circuit; Manufacturer_Name: STMicroelectronics; Datasheet Link: http://www.st.com/web/en/resource/technical/document/datasheet/CD00237391.pdf; Height: 1.6mm; Manufacturer_Part_Number: STM32F205RBT6; Mouser Part Number: 511-STM32F205RBT6; Mouser Price/Stock: https://www.mouser.co.uk/ProductDetail/STMicroelectronics/STM32F205RBT6?qs=ZjM2s42DDyaIgcG0HgMB8w%3D%3D; Arrow Part Number: STM32F205RBT6; Arrow Price/Stock: https://www.arrow.com/en/products/stm32f205rbt6/stmicroelectronics?region=nac
IC2-IC4 IC8-IC11 IC13 IC14 = INA180A3QDBVRQ1: Integrated Circuit; Manufacturer_Name: Texas Instruments; Datasheet Link: http://www.ti.com/lit/gpn/INA180-Q1; Height: 1.45mm; Manufacturer_Part_Number: INA180A3QDBVRQ1; Mouser Part Number: 595-INA180A3QDBVRQ1; Mouser Price/Stock: https://www.mouser.co.uk/ProductDetail/Texas-Instruments/INA180A3QDBVRQ1?qs=9r4v7xj2LnmLNZT0hzb9UA%3D%3D; Arrow Part Number: INA180A3QDBVRQ1; Arrow Price/Stock: https://www.arrow.com/en/products/ina180a3qdbvrq1/texas-instruments?region=nac
IC5 = M24512-WMN6P: Integrated Circuit; Manufacturer_Name: STMicroelectronics; Datasheet Link: http://www.st.com/st-web-ui/static/active/en/resource/technical/document/datasheet/CD00251873.pdf; Height: 1.75mm; Manufacturer_Part_Number: M24512-WMN6P; Mouser Part Number: 511-M24512-WMN6P; Mouser Price/Stock: https://www.mouser.co.uk/ProductDetail/STMicroelectronics/M24512-WMN6P?qs=Djavi1aLnwqEZ2DOkujttQ%3D%3D; Arrow Part Number: M24512-WMN6P; Arrow Price/Stock: https://www.arrow.com/en/products/m24512-wmn6p/stmicroelectronics?region=nac
IC6 IC7 = TJA1051T_3,118: Integrated Circuit; Manufacturer_Name: NXP; Manufacturer_Part_Number: TJA1051T/3,118; Datasheet Link: http://www.nxp.com/docs/en/data-sheet/TJA1051.pdf; Height: 1.75mm; Mouser Part Number: 771-TJA1051T3118; Mouser Price/Stock: https://www.mouser.co.uk/ProductDetail/NXP-Semiconductors/TJA1051T-3118?qs=O%2F7ihdSJpebv1PFlp05wnQ%3D%3D; Arrow Part Number: TJA1051T/3,118; Arrow Price/Stock: https://www.arrow.com/en/products/tja1051t3118/nxp-semiconductors?region=nac
IC12 = MIC29302WU-TR: Integrated Circuit; Manufacturer_Name: Microchip; Datasheet Link: http://ww1.microchip.com/downloads/en/DeviceDoc/20005685A.pdf; Height: 4.597mm; Manufacturer_Part_Number: MIC29302WU-TR; Mouser Part Number: 998-MIC29302WUTR; Mouser Price/Stock: https://www.mouser.co.uk/ProductDetail/Microchip-Technology-Atmel/MIC29302WU-TR?qs=U6T8BxXiZAWR9%2FgJIuiMuA%3D%3D; Arrow Part Number: MIC29302WU-TR; Arrow Price/Stock: https://www.arrow.com/en/products/mic29302wu-tr/microchip-technology?region=nac
IC15 = AMS1117-3.3: Integrated Circuit; Manufacturer_Name: Advanced Monolithic Systems; Datasheet Link: http://www.advanced-monolithic.com/pdf/ds1117.pdf; Height: 1.8mm; Manufacturer_Part_Number: AMS1117-3.3
IC16 = PC817X1NIP1B: Integrated Circuit; Manufacturer_Name: Sharp Microelectronics; Datasheet Link: https://datasheet.datasheetarchive.com/originals/distributors/Datasheets_SAMA/6722695ec663e8d5f4c0406356e05a32.pdf; Height: 4.2mm; Manufacturer_Part_Number: PC817X1NIP1B; Mouser Part Number: 852-PC817X1NIP1B; Mouser Price/Stock: https://www.mouser.co.uk/ProductDetail/Sharp-Microelectronics/PC817X1NIP1B?qs=rrS6PyfT74ek9MvelH%252BjIg%3D%3D; Arrow Part Number: PC817X1NIP1B; Arrow Price/Stock: https://www.arrow.com/en/products/pc817x1nip1b/sharp
IC17 IC18 = TLP281-4_GB,J,F_: Integrated Circuit; Manufacturer_Name: Toshiba; Manufacturer_Part_Number: TLP281-4(GB,J,F); Datasheet Link: https://datasheet.datasheetarchive.com/originals/distributors/Datasheets-SFU1/DSASFU100019514.pdf; Height: 2.1mm; Mouser Part Number: 757-TLP281-4(GB,J,F); Mouser Price/Stock: https://www.mouser.co.uk/ProductDetail/Toshiba/TLP281-4GBJF?qs=L%2FgSpqKJZEs5z2kUHT%252BIpg%3D%3D; Arrow Part Number: TLP281-4(GB,J,F); Arrow Price/Stock: https://www.arrow.com/en/products/tlp281-4-gbjf/toshiba
J1 = UJ2-BH-1-TH: Connector; Manufacturer_Name: CUI Devices; Datasheet Link: http://www.cui.com/product/resource/uj2-bh-th.pdf; Height: 10mm; Manufacturer_Part_Number: UJ2-BH-1-TH; Mouser Part Number: 490-UJ2-BH-1-TH; Mouser Price/Stock: https://www.mouser.co.uk/ProductDetail/CUI-Devices/UJ2-BH-1-TH?qs=5mqXD9RfOg2PqeDe959d6w%3D%3D; Arrow Part Number: UJ2-BH-1-TH; Arrow Price/Stock: https://www.arrow.com/en/products/uj2-bh-1-th/cui-devices?region=nac
LD1-LD13 = LED SMD
P1 P2 = Header 4: Header, 4-Pin; LatestRevisionDate: 17-Jul-2002; LatestRevisionNote: Re-released for DXP Platform.; Publisher: Altium Limited
P3 = Header 2: Header, 2-Pin; LatestRevisionDate: 17-Jul-2002; LatestRevisionNote: Re-released for DXP Platform.; Publisher: Altium Limited
Q1-Q4 Q13-Q16 Q25-Q27 = IRF1010NSPBF: MOSFET (N-Channel); Manufacturer_Name: Infineon; Datasheet Link: https://www.infineon.com/dgdl/Infineon-IRF1010NS-DS-v01_00-EN.pdf?fileId=5546d46258fc0bc10158fee33da90638; Height: 4.83mm; Manufacturer_Part_Number: IRF1010NSPBF; Mouser Part Number: 942-IRF1010NSPBF; Mouser Price/Stock: https://www.mouser.com/Search/Refine.aspx?Keyword=942-IRF1010NSPBF; Arrow Part Number: IRF1010NSPBF; Arrow Price/Stock: https://www.arrow.com/en/products/irf1010nspbf/infineon-technologies-ag
Q5-Q8 Q17-Q20 Q28-Q30 = BC847B,215: Transistor BJT NPN; Manufacturer_Name: Nexperia; Datasheet Link: https://assets.nexperia.com/documents/data-sheet/BC847_SER.pdf; Height: 1.1mm; Manufacturer_Part_Number: BC847B,215; Mouser Part Number: 771-BC847B-T/R; Mouser Price/Stock: https://www.mouser.co.uk/ProductDetail/Nexperia/BC847B215?qs=me8TqzrmIYXXIdUoxWnHgw%3D%3D; Arrow Part Number: BC847B,215; Arrow Price/Stock: https://www.arrow.com/en/products/bc847b215/nexperia?region=nac
Q9-Q12 Q21-Q24 Q31-Q33 = BC857,215: Transistor BJT PNP; Manufacturer_Name: Nexperia; Datasheet Link: https://assets.nexperia.com/documents/data-sheet/BC856_BC857_BC858.pdf; Height: 1.1mm; Manufacturer_Part_Number: BC857,215; Mouser Part Number: 771-BC857215; Mouser Price/Stock: https://www.mouser.co.uk/ProductDetail/Nexperia/BC857215?qs=me8TqzrmIYWtuVsCNoXfHg%3D%3D; Arrow Part Number: BC857,215; Arrow Price/Stock: https://www.arrow.com/en/products/bc857215/nexperia?region=nac
R69 R71-R88 = Resistor SMD
S1 = 1571983-1: Switch; Manufacturer_Name: TE Connectivity; Datasheet Link: https://www.te.com/commerce/DocumentDelivery/DDEController?Action=srchrtrv&DocNm=1571983&DocType=Customer+Drawing&DocLang=English; Height: 2.56mm; Manufacturer_Part_Number: 1571983-1; Mouser Part Number: N/A; Mouser Price/Stock: https://www.mouser.com/Search/Refine.aspx?Keyword=N%2FA; Arrow Part Number: 1571983-1; Arrow Price/Stock: https://www.arrow.com/en/products/1571983-1/te-connectivity
Y1 = Xtal
Z1-Z4 Z6-Z9 Z12-Z14 = 1SMA4753A: Zener Diode; Manufacturer_Name: EIC Semiconductor; Datasheet Link: https://4donline.ihs.com/images/VipMasterIC/IC/EICS/EICS-S-A0005986704/EICS-S-A0005986704-1.pdf?hkey=EF798316E3902B6ED9A73243A3159BB0; Height: 2.5mm; Manufacturer_Part_Number: 1SMA4753A
Z5 = BZV55C3V3_L1: Zener Diode 30V; Manufacturer_Name: Taiwan Semiconductor; Manufacturer_Part_Number: BZV55C3V3 L1; Datasheet Link: http://www.mouser.com/datasheet/2/395/BZV55C2V4_SERIES_G1804-1519273.pdf; Height: 1.6mm; Mouser Part Number: 821-BZV55C3V3L1; Mouser Price/Stock: https://www.mouser.co.uk/ProductDetail/Taiwan-Semiconductor/BZV55C3V3-L1?qs=SikLhao2tv9Br9tNy59wgg%3D%3D; Arrow Part Number: BZV55C3V3 L1; Arrow Price/Stock: https://www.arrow.com/en/products/bzv55c3v3l1/taiwan-semiconductor
Z10 Z15 Z17 Z18 = BZV55C3V3_L1: Zener Diode 3.3V; Manufacturer_Name: Taiwan Semiconductor; Manufacturer_Part_Number: BZV55C3V3 L1; Datasheet Link: http://www.mouser.com/datasheet/2/395/BZV55C2V4_SERIES_G1804-1519273.pdf; Height: 1.6mm; Mouser Part Number: 821-BZV55C3V3L1; Mouser Price/Stock: https://www.mouser.co.uk/ProductDetail/Taiwan-Semiconductor/BZV55C3V3-L1?qs=SikLhao2tv9Br9tNy59wgg%3D%3D; Arrow Part Number: BZV55C3V3 L1; Arrow Price/Stock: https://www.arrow.com/en/products/bzv55c3v3l1/taiwan-semiconductor
Z11 = BZV55C3V3_L1: Zener Diode 5V; Manufacturer_Name: Taiwan Semiconductor; Manufacturer_Part_Number: BZV55C3V3 L1; Datasheet Link: http://www.mouser.com/datasheet/2/395/BZV55C2V4_SERIES_G1804-1519273.pdf; Height: 1.6mm; Mouser Part Number: 821-BZV55C3V3L1; Mouser Price/Stock: https://www.mouser.co.uk/ProductDetail/Taiwan-Semiconductor/BZV55C3V3-L1?qs=SikLhao2tv9Br9tNy59wgg%3D%3D; Arrow Part Number: BZV55C3V3 L1; Arrow Price/Stock: https://www.arrow.com/en/products/bzv55c3v3l1/taiwan-semiconductor
Z16 = BZV55C3V3_L1: Zener Diode 3.3v; Manufacturer_Name: Taiwan Semiconductor; Manufacturer_Part_Number: BZV55C3V3 L1; Datasheet Link: http://www.mouser.com/datasheet/2/395/BZV55C2V4_SERIES_G1804-1519273.pdf; Height: 1.6mm; Mouser Part Number: 821-BZV55C3V3L1; Mouser Price/Stock: https://www.mouser.co.uk/ProductDetail/Taiwan-Semiconductor/BZV55C3V3-L1?qs=SikLhao2tv9Br9tNy59wgg%3D%3D; Arrow Part Number: BZV55C3V3 L1; Arrow Price/Stock: https://www.arrow.com/en/products/bzv55c3v3l1/taiwan-semiconductor